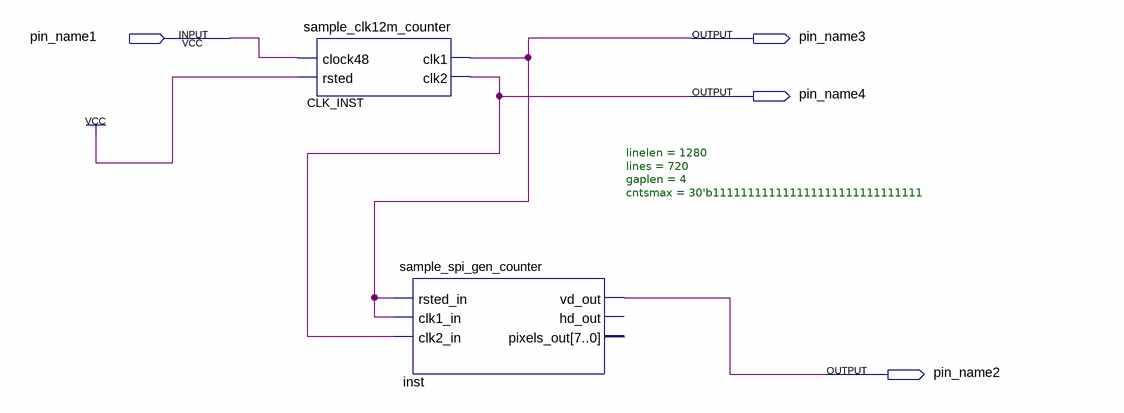
[diagram p0: schematic sheet]
// Quartus schematic spi_gen_top.bdf as structural Verilog: 2 symbols, 4 pins
module spi_gen_top (
  input  pin_name1,
  output pin_name3,
  output pin_name4,
  output pin_name2
);

  sample_clk12m_counter CLK_INST (.clock48(pin_name1), .rsted(1'b1), .clk1(pin_name3), .clk2(pin_name4));
  sample_spi_gen_counter #(.linelen(1280), .lines(720), .gaplen(4), .cntsmax(30'b111111111111111111111111111111)) inst (
    .rsted_in(pin_name3), .clk1_in(pin_name3), .clk2_in(pin_name4), .vd_out(pin_name2));  // open: hd_out, pixels_out
endmodule
